# Altium project KamiGen2.PrjPcb
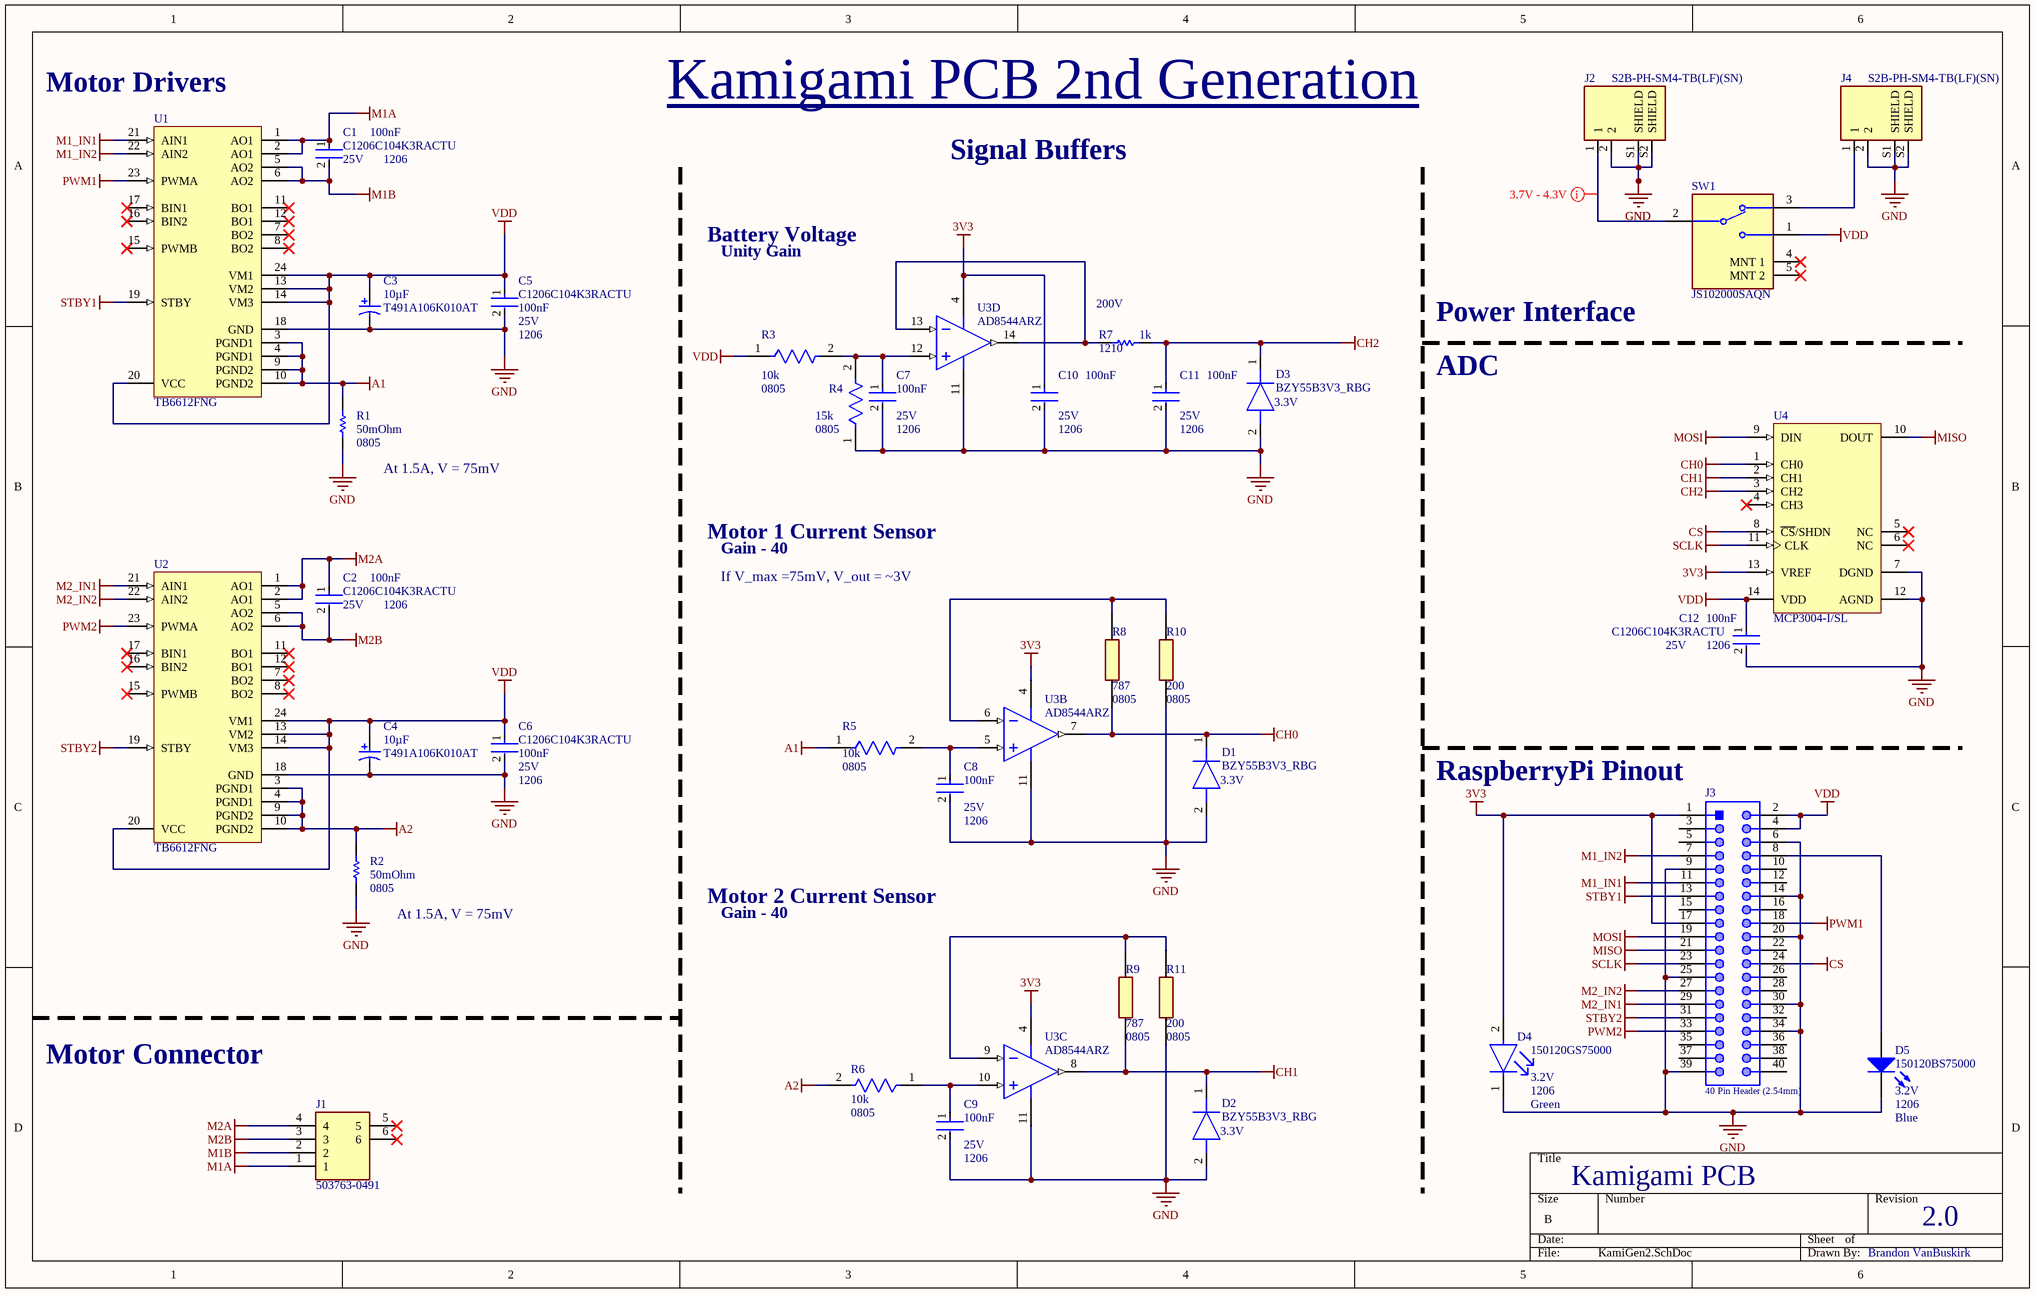
[diagram p0: KamiGen2.SchDoc]
1 sheet, 37 parts. Net scope: global (net labels, ports and power ports of the same name join across sheets).
Board file: KamiGen2.PcbDoc

## Sheet KamiGen2.SchDoc: Kamigami PCB
size B; Date: 5/28/23; Author: Brandon VanBuskirk; CompanyName: Biomimetic Millisystems Laboratory; DrawnBy: Brandon VanBuskirk; Engineer: Brandon VanBuskirk; Revision: 2.0; SheetNumber: 1; SheetTotal: 1; SPICEModelCacheTRZXAFDQ: <root> / <DocumentId>TRZXAFDQ</DocumentId> / </root>

### Parts
C1  C1206C104K3RACTU  value 100nF  Voltage Rating (DC): 25V  Case Code (Imperial): 1206  [FP-C1206C-EB-MFG]
C2  C1206C104K3RACTU  value 100nF  Voltage Rating (DC): 25V  Case Code (Imperial): 1206  [FP-C1206C-EB-MFG]
C3  T491A106K010AT  Capacitance: 10µF  [KEMT-A-3216-18-2_M]
C4  T491A106K010AT  Capacitance: 10µF  [KEMT-A-3216-18-2_M]
C5  C1206C104K3RACTU  value 100nF  Voltage Rating (DC): 25V  Case Code (Imperial): 1206  [FP-C1206C-EB-MFG]
C6  C1206C104K3RACTU  value 100nF  Voltage Rating (DC): 25V  Case Code (Imperial): 1206  [FP-C1206C-EB-MFG]
C7  value 100nF  Voltage Rating (DC): 25V  Case Code (Imperial): 1206  [FP-C1206C-EB-MFG]  (hidden comment: C1206C104K3RACTU)
C8  value 100nF  Voltage Rating (DC): 25V  Case Code (Imperial): 1206  [FP-C1206C-EB-MFG]  (hidden comment: C1206C104K3RACTU)
C9  value 100nF  Voltage Rating (DC): 25V  Case Code (Imperial): 1206  [FP-C1206C-EB-MFG]  (hidden comment: C1206C104K3RACTU)
C10  value 100nF  Voltage Rating (DC): 25V  Case Code (Imperial): 1206  [FP-C1206C-EB-MFG]  (hidden comment: C1206C104K3RACTU)
C11  value 100nF  Voltage Rating (DC): 25V  Case Code (Imperial): 1206  [FP-C1206C-EB-MFG]  (hidden comment: C1206C104K3RACTU)
C12  C1206C104K3RACTU  value 100nF  Voltage Rating (DC): 25V  Case Code (Imperial): 1206  [FP-C1206C-EB-MFG]
D1  BZY55B3V3_RBG  Zener Voltage: 3.3V  [BZY55B3V3RBG]
D2  BZY55B3V3_RBG  Zener Voltage: 3.3V  [BZY55B3V3RBG]
D3  BZY55B3V3_RBG  Zener Voltage: 3.3V  [BZY55B3V3RBG]
D4  150120GS75000  Color: Green  Case/Package: 1206  Forward Voltage: 3.2V  [FP-150120GS75000-MFG]
D5  150120BS75000  PackageReference: 1206  Color: Blue  Forward Voltage: 3.2V  [1206_A]
J1  503763-0491  [5037630491]
J2  S2B-PH-SM4-TB(LF)(SN)  [JST_S2B-PH-SM4-TB(LF)(SN)]
J3  40 Pin Header (2.54mm)  [61304021121]
J4  S2B-PH-SM4-TB(LF)(SN)  [JST_S2B-PH-SM4-TB(LF)(SN)]
R1  Resistance: 50mOhm  Case: 0805  [RESC2013X46X38ML25T25]  (hidden comment: WSL0805R0500FEA)
R2  Resistance: 50mOhm  Case: 0805  [RESC2013X46X38ML25T25]  (hidden comment: WSL0805R0500FEA)
R3  Resistance: 10k  Case/Package: 0805  [FP-CRCW0805-e3-IPC_A]  (hidden comment: CRCW080510K0FKEA)
R4  Case/Package: 0805  Resistance: 15k  [FP-ERJ6EN-IPC_C]  (hidden comment: ERJ-6ENF1502V)
R5  Resistance: 10k  Case/Package: 0805  [FP-CRCW0805-e3-IPC_A]  (hidden comment: CRCW080510K0FKEA)
R6  Resistance: 10k  Case/Package: 0805  [FP-CRCW0805-e3-IPC_A]  (hidden comment: CRCW080510K0FKEA)
R7  value 1k  Case Code (Imperial): 1210  Voltage Rating (DC): 200V  [RESC3225X70X50LL20T20]  (hidden comment: ERJ-14NF1001U)
R8  Resistance: 787  Case: 0805  [RESC2013X65N]  (hidden comment: CRGH0805F787R)
R9  Resistance: 787  Case: 0805  [RESC2013X65N]  (hidden comment: CRGH0805F787R)
R10  Resistance: 200  Case: 0805  [RESC2012X70N]  (hidden comment: ERJ-6RBD2000V)
R11  Resistance: 200  Case: 0805  [RESC2012X70N]  (hidden comment: ERJ-6RBD2000V)
SW1  JS102000SAQN  [FP-JS102000SAQN-MFG]
U1  TB6612FNG  [TOSH-SSOP-24_M]
U2  TB6612FNG  [TOSH-SSOP-24_M]
U3  AD8544ARZ  [ADI-R-14_M]  (parts B,C,D of 4)
U4  MCP3004-I/SL  [SOIC-SL14_L]

### Nets
3V3: C10.1 D4.2(A) J3.1 J3.17 U3.4(+V) U4.13(VREF)
A1: R1.2 R5.1 U1.3(PGND1) U1.4(PGND1) U1.9(PGND2) U1.10(PGND2)
A2: R2.2 R6.2 U2.3(PGND1) U2.4(PGND1) U2.9(PGND2) U2.10(PGND2)
CH0: D1.1(K) R8.1 U3.7(OUT_B) U4.1(CH0)
CH1: D2.1(K) R9.1 U3.8(OUT_C) U4.2(CH1)
CH2: C11.1 D3.1(K) R7.2 U4.3(CH2)
CS: J3.24 U4.8(~{CS}/SHDN)
GND: C3.2 C4.2 C5.2 C6.2 C7.2 C8.2 C9.2 C10.2 C11.2 C12.2 D1.2(A) D2.2(A) D3.2(A) D4.1(C) D5.1(K) J2.2 J2.S1(SHIELD) J2.S2(SHIELD) J3.6 J3.9 J3.14 J3.20 J3.25 J3.30 J3.34 J3.39 J4.2 J4.S1(SHIELD) J4.S2(SHIELD) R1.1 R2.1 R4.1 R10.1 R11.1 U1.18(GND) U2.18(GND) U3.11(-V) U4.7(DGND) U4.12(AGND)
M1_IN1: J3.11 U1.21(AIN1)
M1_IN2: J3.7 U1.22(AIN2)
M1A: C1.1 J1.1 U1.1(AO1) U1.2(AO1)
M1B: C1.2 J1.2 U1.5(AO2) U1.6(AO2)
M2_IN1: J3.29 U2.21(AIN1)
M2_IN2: J3.27 U2.22(AIN2)
M2A: C2.1 J1.4 U2.1(AO1) U2.2(AO1)
M2B: C2.2 J1.3 U2.5(AO2) U2.6(AO2)
MISO: J3.21 U4.10(DOUT)
MOSI: J3.19 U4.9(DIN)
PWM1: J3.18 U1.23(PWMA)
PWM2: J3.33 U2.23(PWMA)
SCLK: J3.23 U4.11(CLK)
STBY1: J3.13 U1.19(STBY)
STBY2: J3.31 U2.19(STBY)
VDD: C3.1 C4.1 C5.1 C6.1 C12.1 J3.2 J3.4 R3.1 SW1.1 U1.13(VM2) U1.14(VM3) U1.20(VCC) U1.24(VM1) U2.13(VM2) U2.14(VM3) U2.20(VCC) U2.24(VM1) U4.14(VDD)
NetC7_1: C7.1 R3.2 R4.2 U3.12(+IN_D)
NetC8_1: C8.1 R5.2 U3.5(+IN_B)
NetC9_1: C9.1 R6.1 U3.10(+IN_C)
NetD5_2: D5.2(A) J3.8
NetJ2_1: J2.1 SW1.2(C)
NetJ4_1: J4.1 SW1.3
NetR7_1: R7.1 U3.13(-IN_D) U3.14(OUT_D)
NetR8_2: R8.2 R10.2 U3.6(-IN_B)
NetR9_2: R9.2 R11.2 U3.9(-IN_C)

Not connected (* = marked no-connect by the designer): J1 5* 6*; J3 3 5 10 12 15 16 22 26 28 32 35 36 37 38 40; SW1 4(MNT_1)* 5(MNT_2)*; U1 7(BO2)* 8(BO2)* 11(BO1)* 12(BO1)* 15(PWMB)* 16(BIN2)* 17(BIN1)*; U2 7(BO2)* 8(BO2)* 11(BO1)* 12(BO1)* 15(PWMB)* 16(BIN2)* 17(BIN1)*; U4 4(CH3)* 5(NC)* 6(NC)*

### Layout directives
Voltage: 3.7 - 4.3V: NetJ2_1

### Notes on the sheet
- (near U1) Motor Drivers
- Kamigami PCB 2nd Generation
- Signal Buffers
- Battery Voltage
- Unity Gain
- (near SW1) Power Interface
- ADC
- (near R1) At 1.5A, V = 75mV
- Motor 1 Current Sensor
- Gain - 40
- If V_max =75mV, V_out = ~3V
- (near J3) RaspberryPi Pinout
- Motor 2 Current Sensor
- (near R2) At 1.5A, V = 75mV
- Motor Connector

### Library data of the parts
C1 C2 C5-C12 = CMP-00100-1: CAP CER 0.1UF 25V 10% X7R 1206; Dissipation Factor: 3.5%; Voltage Rating: 25V; Reach SVHC Compliant: No; Width: 0.063inch; Height: 0.78mm; Dielectric: X7R; Case/Package: 1206; Tolerance: 10%; Min Operating Temperature: -55°C; Depth: 1.6mm; Length: 3.2mm; Package Quantity: 4000; Termination: SMD/SMT; Max Operating Temperature: 125°C; Mounting Technology: Surface Mount; Series: C; Construction: Flat; Packaging: Cut Tape; Thickness: 0.035inch; Case Code (Metric): 3216
C3 C4 = CMP-2000-05172-1: Capacitor, Tantalum, 10 uF, +/- 10%, 10 V, -55 to 125 degC, 2-Pin SMD (1206), RoHS, Tape and Reel; Manufacturer Size Code: A; Manufacturer: Kemet; Type: Molded; Online Catalog: T491Series; Other Names: 399-3684-2; Voltage - Rated: 10V; Lifetime @ Temp.: 2000Hrs@85degC; Product Training Modules: CapacitorBasics-TypicalUsesforCapacitorsDeratingGuidelinesforSurfaceMountTantalumCapacitors; ESR (Equivalent Series Resistance): 3.8Ohm; Catalog Drawings: T49x,T5xxSeries_A-side1T49x,T5xxSeries_A,B-side2T49x,T5xxSeries_A,SBottom; Family: TantalumCapacitors; Manufacturer URL: http://www.kemet.com/; Datasheet URL: http://www.farnell.com/datasheets/1824869.pdf; Package Reference: 1206; Packaging: Tape&Reel(TR); Series: T491; Operating Temperature: -55degC~125degC; Mounting Type: SurfaceMount; Height - Seated (Max): 0.071"(1.80mm); Package / Case: 1206(3216Metric); Package Description: 2-Pin Surface Mount Device, Body 3.2 x 1.6 mm; Features: GeneralPurpose; Tolerance: ±10%; Lead Spacing: -; Size / Dimension: 0.126"Lx0.063"W(3.20mmx1.60mm); Standard Package: 2,000; Datasheet Version: Apr-14; Category: Capacitors
D1-D3 = BZY55B3V3_RBG: Diode; Manufacturer_Name: Taiwan Semiconductor; Manufacturer_Part_Number: BZY55B3V3 RBG; Datasheet Link: https://componentsearchengine.com/Datasheets/1/BZY55B3V3 RBG.pdf; Height: 0.85mm; Mouser Part Number: 821-BZY55B3V3RBG; Mouser Price/Stock: https://www.mouser.co.uk/ProductDetail/Taiwan-Semiconductor/BZY55B3V3-RBG?qs=mAH9sUMRCtvrJdI%2FtfeTug%3D%3D
D4 = CMP-1426-00014-2: LED GREEN CLEAR 1206 SMD; Viewing Angle: 140°; Wavelength: 520nm; Lens Size: 1.6mm; Lens Color: Colorless; Test Current: 20mA; Luminous Intensity: 450mcd; Forward Current: 30mA; Packaging: Cut Tape; Height: 0.69mm; Width: 1.6mm; Lens Transparency: Clear; Mount: Surface Mount; Lens Style: Clear; Case Code (Metric): 3216; Case Code (Imperial): 1206; Package Quantity: 1; RoHS Compliant: Yes; Dominant Wavelength: 520nm; Min Operating Temperature: -40°C; Max Operating Temperature: 85°C; Series: WL-SMCW; Length: 3.2mm
D5 = CMP-1426-00015-1: SMD mono-color Chip LED, WL-SMCW, Blue; Manufacturer: Wuerth Elektronik; ComponentLink2Description: Datasheet; ComponentLink1URL: http://www.we-online.com; PartNumber: 150120BS75000; ComponentLink1Description: Manufacturer URL; ComponentLink2URL: http://katalog.we-online.com/led/datasheet/150120BS75000.pdf
J1 = 503763-0491: Connector; Manufacturer_Name: Molex; Datasheet Link: https://www.molex.com/webdocs/datasheets/pdf/en-us/5037630491_PCB_HEADERS.pdf; Height: 1mm; Manufacturer_Part_Number: 503763-0491; Mouser Part Number: 538-503763-0491; Mouser Price/Stock: https://www.mouser.co.uk/ProductDetail/Molex/503763-0491?qs=zwvsCB%2Fxu0cTZVAek%2FYVrQ%3D%3D
J2 J4 = CMP-064-000001-2: Connector Header Surface Mount, Right Angle 2 position 0.079 (2.00mm); MF: JST Sales; Value: *; Digi-Key_Part_Number: 455-1749-2-ND; Purchase-URL: https://pricing.snapeda.com/search/part/S2B-PH-SM4-TB(LF)(SN)/?ref=eda; Package: None; Check_prices: https://www.snapeda.com/parts/S2B-PH-SM4-TB(LF)(SN)/JST+Sales+America+Inc./view-part/?ref=eda; Component Type: Standard; Pin Count: 4; Design Item ID: S2B-PH-SM4-TB(LF)(SN); MP: S2B-PH-SM4-TB(LF)(SN); SnapEDA_Link: https://www.snapeda.com/parts/S2B-PH-SM4-TB(LF)(SN)/JST+Sales+America+Inc./view-part/?ref=snap; Source: S2B-PH-SM4-TB(LF)(SN).SchLib
J3 = CMP-00112-1: WR-PHD Straight Male, PCB Header, Through Hole, 2 Rows, 40 Contacts, 2.54mm Pitch; Number of Positions: 40; Voltage Rating: 250V; Contact Shape: Square; Contact Plating: Gold; Termination: Solder; Contact Material: Copper Alloy,Copper; Gender: Male; Mounting Technology: Through Hole; Reach SVHC Compliant: Unknown; RoHS Compliant: Yes; Series: WR-PHD; Contact Type: Male Pin; Number of Contacts: 40; Contact Finish - Mating: GOLD; Connector Type: Header; Min Operating Temperature: -40°C; Insulation Color: Black; Insulation Material: Nylon; Flammability Rating: UL94 V-0; Number of Rows: 2; Fastening Type: Pull; Max Operating Temperature: 105°C
R1 R2 = CMP-2001-04327-1: Manufacturer: Vishay Dale; Part Number: WSL0805R0500FEA
R3 R5 R6 = CMP-2001-04908-2: RES Thick Film, 10kΩ, 1%, 0.125W, 100ppm/°C, 0805; Voltage Rating (DC): 150V; Power Rating: 125mW; Weight: 0.000194oz; Package Quantity: 5000; Military Standard: Not; Max Operating Temperature: 155°C; Temperature Coefficient: 100ppm/°C; Contact Plating: Tin; Width: 1.25mm; Height: 0.45mm; Radiation Hardening: No; Tolerance: 1%; Min Operating Temperature: -55°C; Voltage Rating: 150V; Length: 2mm; Depth: 1.25mm; Termination: SMD/SMT; Packaging: Tape and Reel; Case Code (Metric): 2012; Lead Free: Lead Free; Case Code (Imperial): 0805; Composition: Thick Film
R4 = CMP-2001-04439-3: RES SMD 15K OHM 1% 1/8W 0805; Max Power Dissipation: 125mW; Voltage Rating (DC): 150V; Temperature Coefficient: 100ppm/°C; Construction: Rectangular; RoHS Compliant: Yes; Mount: Surface Mount; Military Standard: Not; Depth: 1.25mm; Resistance Tolerance: 1%; Termination: SMD/SMT; Reach SVHC Compliant: Yes; Package Quantity: 1; Voltage Rating: 150V; Power Rating: 125mW; Resistor Type: Thick Film; Features: Automotive AEC-Q200; Radiation Hardening: No; Number of Terminations: 2; Case Code (Metric): 2012; Tolerance: 1%; Packaging: Tape and Reel; Number of Pins: 2; Technology: THICK FILM; Size Code: 0805; Max Operating Temperature: 155°C; Min Operating Temperature: -55°C; Height: 0.6mm; Lead Free: Lead Free; Series: ERJ; Case Code (Imperial): 0805; Contact Plating: Tin; Width: 1.2mm; Length: 2mm
R7 = CMP-00078-1: Res Thick Film 1210 1K Ohm 1% 1/2W ±100ppm/°C Molded SMD Embossed Carrier T/R; Max Power Dissipation: 500mW; Min Operating Temperature: -55°C; Packaging: Tape and Reel; Termination: SMD/SMT; Weight: 0.000564oz; Case/Package: 1210; Length: 3.2mm; Contact Plating: Tin; Ratings: AEC-Q200; Max Operating Temperature: 155°C; Number of Terminations: 2; Temperature Coefficient: 100ppm/°C; Resistor Type: Thick Film; Width: 2.5mm; Series: ERJ; Lead Free: Lead Free; Construction: Rectangular; Package Quantity: 5000; RoHS Compliant: Yes; Radiation Hardening: No; Mounting Technology: Surface Mount; Military Standard: Not; Depth: 2.5mm; Technology: THICK FILM; Features: Automotive AEC-Q200; Case Code (Metric): 3225; Resistance Tolerance: 1%; Tolerance: 1%; Height: 0.6mm; Voltage Rating: 200V; Power Rating: 500mW
R8 R9 = CRGH0805F787R: Resistor; Manufacturer_Name: TE Connectivity; Datasheet Link: http://docs-europe.electrocomponents.com/webdocs/12d7/0900766b812d7379.pdf; Height: 0.65mm; Manufacturer_Part_Number: CRGH0805F787R; Mouser Part Number: 279-CRGH0805F787R; Mouser Price/Stock: https://www.mouser.co.uk/ProductDetail/TE-Connectivity-AMP/CRGH0805F787R?qs=HLeXuo0aL2qb48ulaDUW5w%3D%3D
R10 R11 = ERJ-6RBD2000V: Resistor; Manufacturer_Name: Panasonic; Datasheet Link: https://datasheet.datasheetarchive.com/originals/distributors/DKDS41/DSANUWW0038499.pdf; Height: 0.7mm; Manufacturer_Part_Number: ERJ-6RBD2000V; Mouser Part Number: 667-ERJ-6RBD2000V; Mouser Price/Stock: https://www.mouser.com/Search/Refine.aspx?Keyword=667-ERJ-6RBD2000V; Arrow Part Number: ERJ-6RBD2000V; Arrow Price/Stock: https://www.arrow.com/en/products/erj6rbd2000v/panasonic
SW1 = CMP-00098-1: Slide Switch, Js Series, SPDT, Right Angle, SMD, 1 ma Rohs Compliant: Yes; Contact Current Rating: 1mA; Max Voltage Rating (DC): 5V; Electrical Life: 15000Cycles; Switch Travel: 1.5mm; Actuator Color: Black; Switch Function: On-On; Actuator Type: Standard; Actuator Material: Nylon,Polyamide,PA46; Contact Resistance: 70mR; Min Operating Temperature: -40°C; Throw Configuration: SPDT; Contact Material: Copper Alloy; Housing Material: Nylon; Current Rating: 1mA; Packaging: Tape and Reel; Flammability Rating: UL94 V-2; Orientation: Right Angle; Contact Plating: Silver; Length: 7.8mm; Mounting Technology: Surface Mount; Actuator Length: 1.5mm; Series: JS; Max Current Rating: 1mA; Termination: Gull Wing; Reach SVHC Compliant: No; Voltage Rating (DC): 5V; Package Quantity: 1; Depth: 4.82mm; Max Operating Temperature: 85°C
U1 U2 = CMP-1773-00001-1: Driver IC for Dual DC Motor, 15 V, -20 to 85 degC, 24-Pin SSOP, RoHS, Tape and Reel; Elements: 2; Max Power Dissipation: 200 mW; Max Surge Current: 100 mA; Element Configuration: Common Cathode; Case\Package: TO-236-3; Forward Voltage: 1 V; Peak Reverse Current: 0.1 uA; Forward Current: 70 mA; Recovery Time: 5 ns; Radiation Hardening: No; Packaging: Tape and Reel; ComponentLink2Description: Datasheet; REACH SVHC: No SVHC; ComponentLink2URL: https://toshiba.semicon-storage.com/info/docget.jsp?did=10660&prodName=TB6612FNG; RoHSCompliant: true; DatasheetVersion: Oct-14; PackageDescription: 24-Pin Shrink Small Outline Package Integrated Circuit, Body 7.8 x 5.6 mm, Pitch 0.65 mm; Package Quantity: 3000; Length: 3 mm; Pins: 3; Mount: Surface Mount; ComponentLink1Description: Manufacturer URL; PackageReference: SSOP-24; ComponentLink1URL: http://www.toshiba.com/; Width: 1.4 mm; Max Operating Temperature: 125 degC; Height: 1.1 mm; Min Operating Temperature: -55 degC
U3 = CMP-00114-1: Operational Amplifier, Quad, 1 Mhz, 4, 0.92 V/ S, 2.7V To 5.5V, Soic, 14 Rohs Compliant: Yes; Number of Amplifiers: 4; Quiescent Current: 65uA; Output Current per Channel: 30mA; Amplifier Type: GENERAL PURPOSE; Operating Supply Current: 260uA; Input Voltage Noise Density: 42nV/sqrt Hz; Unity Gain Bandwidth Product: 1MHz; Slew Rate: 0.92V/µs; Power Supply Rejection Ratio (PSRR): 76dB; Operating Supply Voltage: 5V; Voltage Gain: 92.04dB; Input Bias Current: 4pA; Input Offset Voltage (Vos): 6mV; Settling Time: 6us; Common Mode Rejection Ratio: 40dB; Number of Channels: 4; Max Supply Voltage: 5.5V; Min Operating Temperature: -40°C; Width: 4mm; Series: -; Height: 1.5mm; Case/Package: R; Radiation Hardening: No; Min Supply Voltage: 2.7V; Packaging: Rail/Tube; Max Operating Temperature: 125°C; Gain Bandwidth Product: 1MHz; Package Quantity: 56; Lead Free: Contains Lead; Contact Plating: Tin,Matte; Number of Circuits: 4; Pins: 14; Bandwidth: 1MHz; RoHS Compliant: Yes; Technology: CMOS; Reach SVHC Compliant: No; Number of Elements: 4; Length: 8.75mm
U4 = CMP-014-000002-1: 4-Channel Single ADC SAR 200ksps 10-bit Serial Automotive 14-Pin SOIC N Tube